# Altium schematic sheet S3C_IOs1V8.SchDoc
size A4; Organization: UltraZohm; SheetNumber: 10
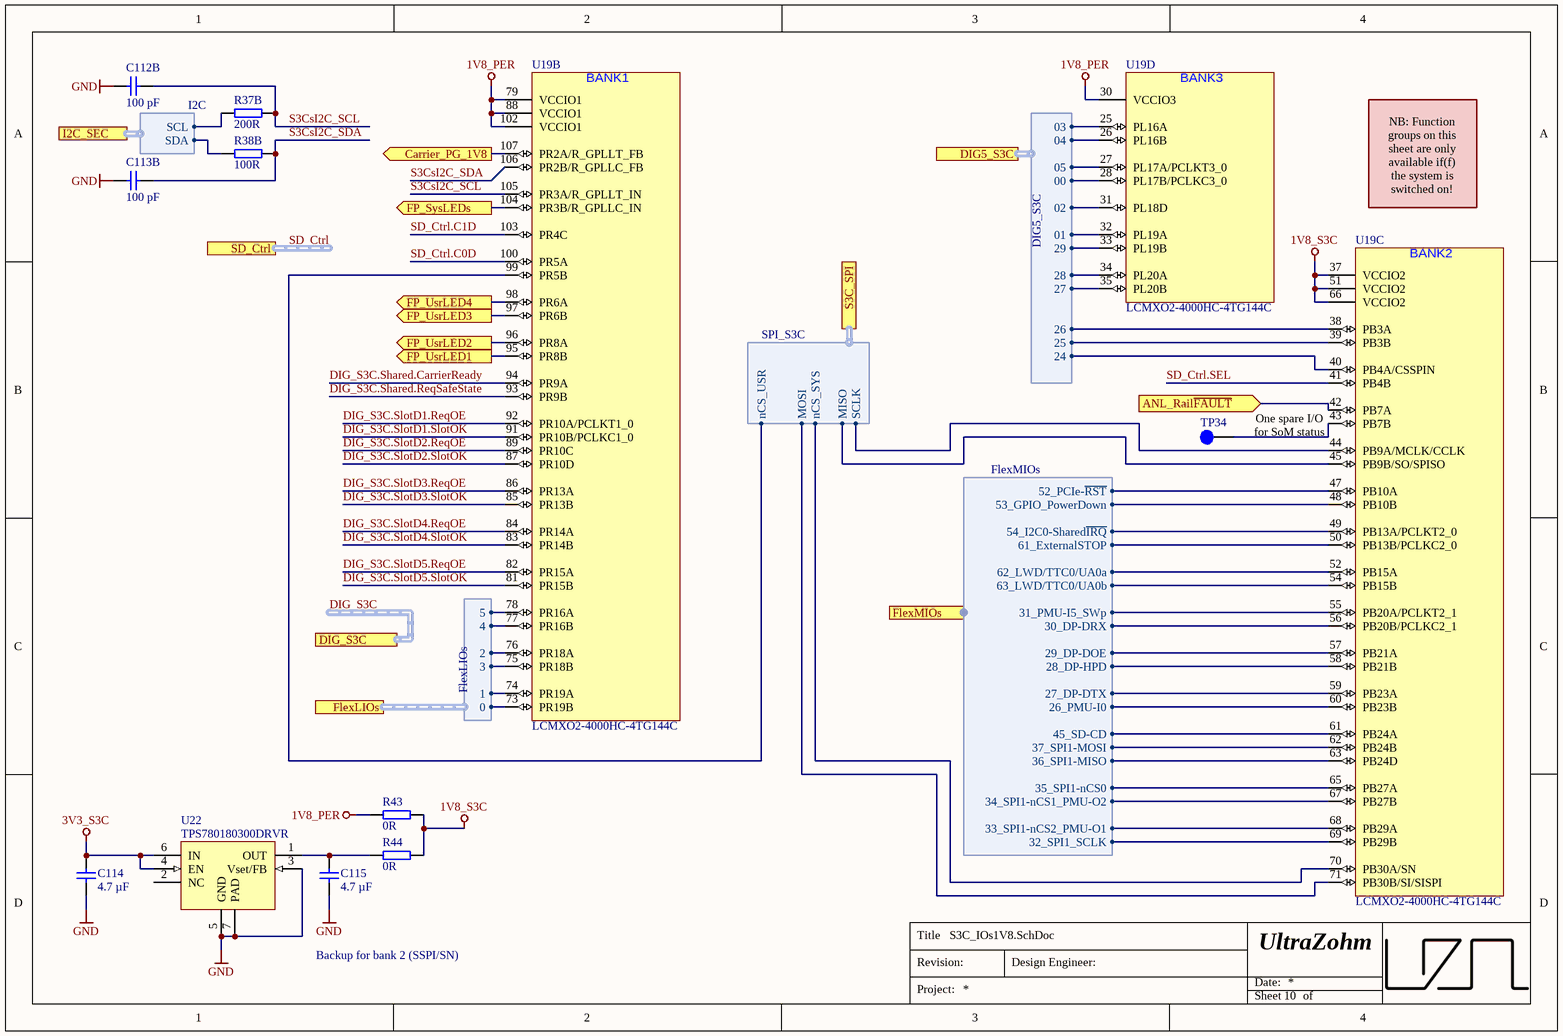
[diagram p0: S3C_IOs1V8.SchDoc]

## Parts
C112B  100 pF  [C_0603_TE]
C113B  100 pF  [C_0603_TE]
C114  4.7 µF  [C_0603_TE]
C115  4.7 µF  [C_0603_TE]
R37B  200R  [R_0603_TE]
R38B  100R  [R_0603_TE]
R43  0R  [R_1206_TE]
R44  0R  [R_1206_TE]
TP34  Testpoint 1mm  [TP_1mm]  (value not drawn)  (no BOM)
U19  LCMXO2-4000HC-4TG144C  [QFP50P2200X2200X160-144N]  (parts B,C,D of 7)
U22  TPS780180300DRVR  [SON65P200X200X80-7N]

## Ports
ANL_Rail~{FAULT} (in), Carrier_PG_1V8 (out), DIG5_S3C (harness DIG5_S3C), DIG_S3C (harness DIG_S3C), FlexLIOs (harness FlexLIOs), FlexMIOs (harness FlexMIOs), FP_SysLEDs (out), FP_UsrLED1 (out), FP_UsrLED2 (out), FP_UsrLED3 (out), FP_UsrLED4 (out), I2C_SEC (harness I2C), S3C_SPI (harness SPI_S3C), SD_Ctrl (harness SD_Ctrl)

## Harnesses
FlexMIOs: 26_PMU-I0, 27_DP-DTX, 28_DP-HPD, 29_DP-DOE, 30_DP-DRX, 31_PMU-I5_SWp, 32_SPI1_SCLK, 33_SPI1-nCS2_PMU-O1, 34_SPI1-nCS1_PMU-O2, 35_SPI1-nCS0, 36_SPI1-MISO, 37_SPI1-MOSI, 45_SD-CD, 52_PCIe-~{RST}, 53_GPIO_PowerDown, 54_I2C0-Shared~{IRQ}, 61_ExternalSTOP, 62_LWD/TTC0/UA0a, 63_LWD/TTC0/UA0b
DIG5_S3C: 00, 01, 02, 03, 04, 05, 24, 25, 26, 27, 28, 29
I2C: SCL, SDA
SPI_S3C: SCLK, MOSI, MISO, nCS_SYS, nCS_USR
FlexLIOs: 0, 1, 2, 3, 4, 5

## Nets
1V8_PER: R43.1 U19.30(VCCIO3) U19.79(VCCIO1) U19.88(VCCIO1) U19.102(VCCIO1)
1V8_S3C: R43.2 R44.2 U19.37(VCCIO2) U19.51(VCCIO2) U19.66(VCCIO2)
3V3_S3C: C114.2 U22.4(EN) U22.6(IN)
GND: C112B.2 C113B.2 C114.1 C115.1 U22.3(Vset/FB) U22.5(GND) U22.7(PAD)
ANL_Rail~{FAULT}: U19.42(PB7A) ; port ANL_Rail~{FAULT}
Carrier_PG_1V8: U19.107(PR2A/R_GPLLT_FB) ; port Carrier_PG_1V8
DIG_S3C.Shared.CarrierReady: U19.94(PR9A)
DIG_S3C.Shared.ReqSafeState: U19.93(PR9B)
DIG_S3C.SlotD1.ReqOE: U19.92(PR10A/PCLKT1_0)
DIG_S3C.SlotD1.SlotOK: U19.91(PR10B/PCLKC1_0)
DIG_S3C.SlotD2.ReqOE: U19.89(PR10C)
DIG_S3C.SlotD2.SlotOK: U19.87(PR10D)
DIG_S3C.SlotD3.ReqOE: U19.86(PR13A)
DIG_S3C.SlotD3.SlotOK: U19.85(PR13B)
DIG_S3C.SlotD4.ReqOE: U19.84(PR14A)
DIG_S3C.SlotD4.SlotOK: U19.83(PR14B)
DIG_S3C.SlotD5.ReqOE: U19.82(PR15A)
DIG_S3C.SlotD5.SlotOK: U19.81(PR15B)
FP_SysLEDs: U19.104(PR3B/R_GPLLC_IN) ; port FP_SysLEDs
FP_UsrLED1: U19.95(PR8B) ; port FP_UsrLED1
FP_UsrLED2: U19.96(PR8A) ; port FP_UsrLED2
FP_UsrLED3: U19.97(PR6B) ; port FP_UsrLED3
FP_UsrLED4: U19.98(PR6A) ; port FP_UsrLED4
S3CsI2C_SCL: C112B.1 R37B.2 U19.105(PR3A/R_GPLLT_IN)
S3CsI2C_SDA: C113B.1 R38B.2 U19.106(PR2B/R_GPLLC_FB)
SD_Ctrl.C0D: U19.100(PR5A)
SD_Ctrl.C1D: U19.103(PR4C)
SD_Ctrl.SEL: U19.41(PB4B)
NetC115_2: C115.2 R44.1 U22.1(OUT)
NetR37B_1: R37B.1 ; port I2C_SEC.SCL
NetR38B_1: R38B.1 ; port I2C_SEC.SDA
NetTP34_1: TP34.1 U19.43(PB7B)
NetU19_25: U19.25(PL16A) ; port DIG5_S3C.03
NetU19_26: U19.26(PL16B) ; port DIG5_S3C.04
NetU19_27: U19.27(PL17A/PCLKT3_0) ; port DIG5_S3C.05
NetU19_28: U19.28(PL17B/PCLKC3_0) ; port DIG5_S3C.00
NetU19_31: U19.31(PL18D) ; port DIG5_S3C.02
NetU19_32: U19.32(PL19A) ; port DIG5_S3C.01
NetU19_33: U19.33(PL19B) ; port DIG5_S3C.29
NetU19_34: U19.34(PL20A) ; port DIG5_S3C.28
NetU19_35: U19.35(PL20B) ; port DIG5_S3C.27
NetU19_38: U19.38(PB3A) ; port DIG5_S3C.26
NetU19_39: U19.39(PB3B) ; port DIG5_S3C.25
NetU19_40: U19.40(PB4A/CSSPIN) ; port DIG5_S3C.24
NetU19_44: U19.44(PB9A/MCLK/CCLK) ; port S3C_SPI.SCLK
NetU19_45: U19.45(PB9B/SO/SPISO) ; port S3C_SPI.MISO
NetU19_47: U19.47(PB10A) ; port FlexMIOs.52_PCIe-~{RST}
NetU19_48: U19.48(PB10B) ; port FlexMIOs.53_GPIO_PowerDown
NetU19_49: U19.49(PB13A/PCLKT2_0) ; port FlexMIOs.54_I2C0-Shared~{IRQ}
NetU19_50: U19.50(PB13B/PCLKC2_0) ; port FlexMIOs.61_ExternalSTOP
NetU19_52: U19.52(PB15A) ; port FlexMIOs.62_LWD/TTC0/UA0a
NetU19_54: U19.54(PB15B) ; port FlexMIOs.63_LWD/TTC0/UA0b
NetU19_55: U19.55(PB20A/PCLKT2_1) ; port FlexMIOs.31_PMU-I5_SWp
NetU19_56: U19.56(PB20B/PCLKC2_1) ; port FlexMIOs.30_DP-DRX
NetU19_57: U19.57(PB21A) ; port FlexMIOs.29_DP-DOE
NetU19_58: U19.58(PB21B) ; port FlexMIOs.28_DP-HPD
NetU19_59: U19.59(PB23A) ; port FlexMIOs.27_DP-DTX
NetU19_60: U19.60(PB23B) ; port FlexMIOs.26_PMU-I0
NetU19_61: U19.61(PB24A) ; port FlexMIOs.45_SD-CD
NetU19_62: U19.62(PB24B) ; port FlexMIOs.37_SPI1-MOSI
NetU19_63: U19.63(PB24D) ; port FlexMIOs.36_SPI1-MISO
NetU19_65: U19.65(PB27A) ; port FlexMIOs.35_SPI1-nCS0
NetU19_67: U19.67(PB27B) ; port FlexMIOs.34_SPI1-nCS1_PMU-O2
NetU19_68: U19.68(PB29A) ; port FlexMIOs.33_SPI1-nCS2_PMU-O1
NetU19_69: U19.69(PB29B) ; port FlexMIOs.32_SPI1_SCLK
NetU19_70: U19.70(PB30A/SN) ; port S3C_SPI.nCS_SYS
NetU19_71: U19.71(PB30B/SI/SISPI) ; port S3C_SPI.MOSI
NetU19_73: U19.73(PR19B) ; port FlexLIOs.0
NetU19_74: U19.74(PR19A) ; port FlexLIOs.1
NetU19_75: U19.75(PR18B) ; port FlexLIOs.3
NetU19_76: U19.76(PR18A) ; port FlexLIOs.2
NetU19_77: U19.77(PR16B) ; port FlexLIOs.4
NetU19_78: U19.78(PR16A) ; port FlexLIOs.5
NetU19_99: U19.99(PR5B) ; port S3C_SPI.nCS_USR

Not connected (* = marked no-connect by the designer): U22 2(NC)

## Buses and harness runs
harness DIG_S3C = port DIG_S3C
harness SD_Ctrl = port SD_Ctrl

## Notes on the sheet
- NB: Function groups on this sheet are only available if(f) the system is switched on!
- One spare I/O
  for SoM status
- Backup for bank 2 (SSPI/SN)
- Title
- Revision:
- Design Engineer:
- Date:
- Project:
- Sheet
- of
- (in symbol LCMXO2-4000HC-4TG144C, part B) BANK1
- (in symbol LCMXO2-4000HC-4TG144C, part C) BANK2
- (in symbol LCMXO2-4000HC-4TG144C, part D) BANK3

## Library data of the parts
C112B C113B = UZgen_C_0603_100pF_50V_X7R: Generic capacitor; Manufacturer: UZgen; Voltage: 50V; Tolerance: 10 %; Created from: UZgenTool; Manufacturer Part Number: UZgen_C_0603_100pF_50V_X7R; PartID: 4215; Created On: 02/08/2024 11:18:08; Value: 100 pF; Device Package: 0603; Technology: X7R; Mounting Type: SMD; Last Updated: 02/08/2024 11:18:08
C114 C115 = UZgen_C_0603_4.7uF_16V_X5R: Generic capacitor; Manufacturer: UZgen; Voltage: 16V; Tolerance: 10 %; Created from: MGeier; Manufacturer Part Number: UZgen_C_0603_4.7uF_16V_X5R; PartID: 5809; Created On: 20/03/2025 14:43:45; Value: 4.7 µF; Device Package: 0603; Technology: X5R; Mounting Type: SMD; Last Updated: 20/03/2025 14:43:45
R37B = UZgen_R_0603_200R: Generic resistor; Manufacturer: UZgen; Tolerance: 1 %; Created from: UZgenTool; Manufacturer Part Number: UZgen_R_0603_200R; PartID: 204; Created On: 02/07/2024 17:29:49; Value: 200R; Device Package: 0603; Mounting Type: SMD; Last Updated: 02/07/2024 17:29:49
R38B = UZgen_R_0603_100R: Generic resistor; Manufacturer: UZgen; Tolerance: 1 %; Created from: UZgenTool; Manufacturer Part Number: UZgen_R_0603_100R; PartID: 197; Created On: 02/07/2024 17:29:48; Value: 100R; Device Package: 0603; Mounting Type: SMD; Last Updated: 02/07/2024 17:29:48
R43 R44 = UZgen_R_1206_0R: Generic resistor; Manufacturer: UZgen; Tolerance: 1 %; Created from: UZgenTool; Manufacturer Part Number: UZgen_R_1206_0R; PartID: 583; Created On: 08/07/2024 14:34:30; Value: 0R; Device Package: 1206; Mounting Type: SMD; Last Updated: 08/07/2024 14:34:30
TP34 = NULL: Manufacturer Part Number: NULL; Created from: AGeiger; Created: 2018_06_25_AGeiger; Value: Testpoint 1mm; PartID: 9; Created On: 20/09/2022 13:14:57; Component Type: Testpoint; Last Updated: 20/09/2022 13:15:39; Manufacturer: NULL; Supplier 1: NULL; Supplier Part Number 1: NULL; Type: Testpoint; Live Cycle Status: 1
U19 = LCMXO2-4000HC-4TG144C: TQFP-144(20x20) Programmable Logic Device (CPLDs/FPGAs) ROHS; Manufacturer: Lattice; Created from: FRosner; Manufacturer Part Number: LCMXO2-4000HC-4TG144C; PartID: 38; Created On: 03/07/2024 17:33:36; ComponentLink1Description: Datasheet; ComponentLink1URL: https://wmsc.lcsc.com/wmsc/upload/file/pdf/v2/lcsc/2403111456_Lattice-LCMXO2-4000HC-4TG144C_C1521625.pdf; Component Type: CPLD; Device Package: TQFP-144; Last Updated: 23/08/2024 11:42:29; Mounting Type: SMD; Operating Temperature: -0 to +85 °C; Supplier 1: LCSC; Supplier Part Number 1: C1521625; Supplier 2: Mouser; Supplier Part Number 2: 842-XO24000HC4TG144C; Type: CPLD; Live Cycle Status: 1; LCSC Part Number: C1521625; Stock number: not stored
U22 = TPS780180300DRVR: LDO Voltage Regulators 150mA,LDO Reg,Ultra Low Pwr; Manufacturer: Texas Instruments; Value: 1.8 V, 3 V; Created from: FRosner; Manufacturer Part Number: TPS780180300DRVR; PartID: 17; Created On: 02/07/2024 16:16:00; ComponentLink1Description: Datasheet; ComponentLink1URL: https://wmsc.lcsc.com/wmsc/upload/file/pdf/v2/lcsc/2302220830_Texas-Instruments-TPS780180300DRVR_C2860011.pdf; Component Type: LDO; Device Package: SMD; Last Updated: 03/09/2024 16:21:15; Mounting Type: SMD; Operating Temperature: -40 to +125 °C; Series: TPS780; Supplier 1: Mouser; Supplier Part Number 1: 595-TPS780180300DRVR; Supplier 2: LCSC; Supplier Part Number 2: C2860011; Type: LDO; Live Cycle Status: 1; LCSC Part Number: C2860011; Stock number: not stored